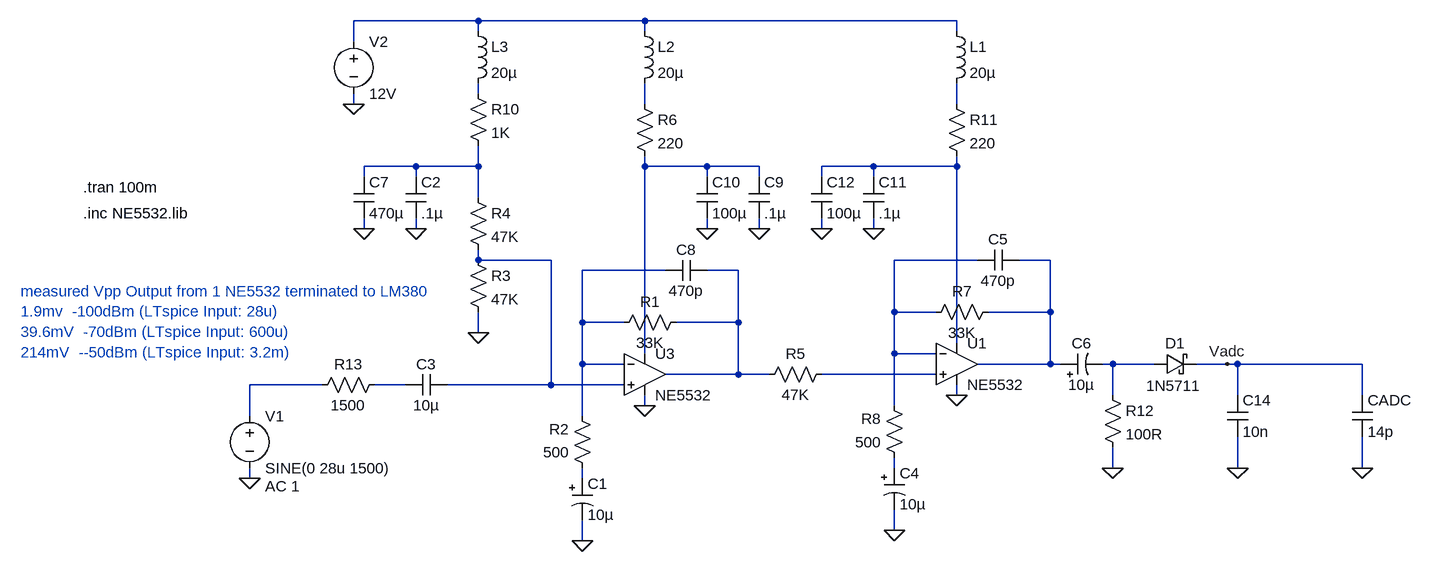
[diagram p0: schematic SMeter Detector NE5532.asc]
SMeter Detector NE5532.asc, the LTspice schematic file:
Version 4
SHEET 1 2204 680
WIRE 96 -400 -96 -400
WIRE 352 -400 96 -400
WIRE 832 -400 352 -400
WIRE 96 -384 96 -400
WIRE 352 -384 352 -400
WIRE 832 -384 832 -400
WIRE -96 -368 -96 -400
WIRE 96 -288 96 -304
WIRE -96 -272 -96 -288
WIRE 352 -272 352 -304
WIRE 832 -272 832 -304
WIRE 0 -176 -80 -176
WIRE 96 -176 96 -208
WIRE 96 -176 0 -176
WIRE 352 -176 352 -192
WIRE 448 -176 352 -176
WIRE 528 -176 448 -176
WIRE 704 -176 624 -176
WIRE 832 -176 832 -192
WIRE 832 -176 704 -176
WIRE -80 -160 -80 -176
WIRE 0 -160 0 -176
WIRE 448 -160 448 -176
WIRE 528 -160 528 -176
WIRE 624 -160 624 -176
WIRE 704 -160 704 -176
WIRE 96 -128 96 -176
WIRE -80 -80 -80 -96
WIRE 0 -80 0 -96
WIRE 448 -80 448 -96
WIRE 528 -80 528 -96
WIRE 624 -80 624 -96
WIRE 704 -80 704 -96
WIRE 96 -32 96 -48
WIRE 208 -32 96 -32
WIRE 864 -32 736 -32
WIRE 976 -32 928 -32
WIRE 384 -16 256 -16
WIRE 496 -16 448 -16
WIRE 736 48 736 -32
WIRE 800 48 736 48
WIRE 976 48 976 -32
WIRE 976 48 880 48
WIRE 256 64 256 -16
WIRE 320 64 256 64
WIRE 496 64 496 -16
WIRE 496 64 400 64
WIRE 96 80 96 48
WIRE 832 96 832 -176
WIRE 352 112 352 -176
WIRE 736 112 736 48
WIRE 800 112 736 112
WIRE 256 128 256 64
WIRE 320 128 256 128
WIRE 976 128 976 48
WIRE 976 128 864 128
WIRE 992 128 976 128
WIRE 1072 128 1056 128
WIRE 1136 128 1072 128
WIRE 1248 128 1200 128
WIRE 1264 128 1248 128
WIRE 1456 128 1264 128
WIRE 496 144 496 64
WIRE 496 144 384 144
WIRE 544 144 496 144
WIRE 800 144 624 144
WIRE -144 160 -256 160
WIRE -16 160 -64 160
WIRE 208 160 208 -32
WIRE 208 160 48 160
WIRE 320 160 208 160
WIRE 832 176 832 160
WIRE 1072 176 1072 128
WIRE 1264 176 1264 128
WIRE 1456 176 1456 128
WIRE 352 192 352 176
WIRE 736 192 736 112
WIRE -256 208 -256 160
WIRE 256 208 256 128
WIRE 736 288 736 272
WIRE 1072 288 1072 256
WIRE 1264 288 1264 240
WIRE 1456 288 1456 240
WIRE -256 304 -256 288
WIRE 256 304 256 288
WIRE 736 384 736 352
WIRE 256 400 256 368
FLAG -96 -272 0
FLAG -256 304 0
FLAG 1264 288 0
FLAG 1456 288 0
FLAG 1248 128 Vadc
FLAG 1072 288 0
FLAG 256 400 0
FLAG 96 80 0
FLAG 352 192 0
FLAG 736 384 0
FLAG 832 176 0
FLAG -80 -80 0
FLAG 0 -80 0
FLAG 448 -80 0
FLAG 528 -80 0
FLAG 624 -80 0
FLAG 704 -80 0
SYMBOL cap 48 144 R90
WINDOW 0 0 32 VBottom 2
WINDOW 3 32 32 VTop 2
SYMATTR InstName C3
SYMATTR Value 10µ
SYMBOL voltage -256 192 R0
WINDOW 123 24 124 Left 2
WINDOW 39 0 0 Left 2
SYMATTR Value2 AC 1
SYMATTR InstName V1
SYMATTR Value SINE(0 28u 1500)
SYMBOL voltage -96 -384 R0
WINDOW 123 0 0 Left 2
WINDOW 39 0 0 Left 2
SYMATTR InstName V2
SYMATTR Value 12V
SYMBOL schottky 1136 144 R270
WINDOW 0 32 32 VTop 2
WINDOW 3 -2 30 VBottom 2
SYMATTR InstName D1
SYMATTR Value 1N5711
SYMATTR Description Diode
SYMATTR Type diode
SYMBOL cap 1248 176 R0
SYMATTR InstName C14
SYMATTR Value 10n
SYMBOL cap 1440 176 R0
SYMATTR InstName CADC
SYMATTR Value 14p
SYMBOL res 1056 160 R0
SYMATTR InstName R12
SYMATTR Value 100R
SYMBOL OpAmps\\opamp2 352 80 R0
SYMATTR InstName U3
SYMATTR Value NE5532
SYMBOL res 416 48 R90
WINDOW 0 0 56 VBottom 2
WINDOW 3 32 56 VTop 2
SYMATTR InstName R1
SYMATTR Value 33K
SYMBOL res 272 304 R180
WINDOW 0 36 76 Left 2
WINDOW 3 36 40 Left 2
SYMATTR InstName R2
SYMATTR Value 500
SYMBOL polcap 240 304 R0
WINDOW 3 24 56 Left 2
SYMATTR Value 10µ
SYMATTR InstName C1
SYMATTR Description Capacitor
SYMATTR Type cap
SYMATTR SpiceLine V=16 Irms=35m Rser=1.95183 Lser=4.15924n mfg="Würth Elektronik" pn="860020372001 WCAP-ATG5 5x11" type="Al electrolytic"
SYMBOL res 80 -48 R0
SYMATTR InstName R3
SYMATTR Value 47K
SYMBOL res 80 -144 R0
SYMATTR InstName R4
SYMATTR Value 47K
SYMBOL res 336 -288 R0
SYMATTR InstName R6
SYMATTR Value 220
SYMBOL res 816 -288 R0
SYMATTR InstName R11
SYMATTR Value 220
SYMBOL cap 384 0 R270
WINDOW 0 32 32 VTop 2
WINDOW 3 0 32 VBottom 2
SYMATTR InstName C8
SYMATTR Value 470p
SYMBOL OpAmps\\opamp2 832 64 R0
SYMATTR InstName U1
SYMATTR Value NE5532
SYMBOL res 896 32 R90
WINDOW 0 0 56 VBottom 2
WINDOW 3 32 56 VTop 2
SYMATTR InstName R7
SYMATTR Value 33K
SYMBOL res 752 288 R180
WINDOW 0 36 76 Left 2
WINDOW 3 36 40 Left 2
SYMATTR InstName R8
SYMATTR Value 500
SYMBOL polcap 720 288 R0
WINDOW 3 24 56 Left 2
SYMATTR Value 10µ
SYMATTR InstName C4
SYMATTR Description Capacitor
SYMATTR Type cap
SYMATTR SpiceLine V=16 Irms=35m Rser=1.95183 Lser=4.15924n mfg="Würth Elektronik" pn="860020372001 WCAP-ATG5 5x11" type="Al electrolytic"
SYMBOL cap 864 -16 R270
WINDOW 0 32 32 VTop 2
WINDOW 3 0 32 VBottom 2
SYMATTR InstName C5
SYMATTR Value 470p
SYMBOL res 640 128 R90
WINDOW 0 0 56 VBottom 2
WINDOW 3 32 56 VTop 2
SYMATTR InstName R5
SYMATTR Value 47K
SYMBOL ind 816 -400 R0
SYMATTR InstName L1
SYMATTR Value 20µ
SYMBOL ind 336 -400 R0
SYMATTR InstName L2
SYMATTR Value 20µ
SYMBOL ind 80 -400 R0
SYMATTR InstName L3
SYMATTR Value 20µ
SYMBOL res 80 -304 R0
SYMATTR InstName R10
SYMATTR Value 1K
SYMBOL cap -16 -160 R0
SYMATTR InstName C2
SYMATTR Value .1µ
SYMBOL cap -96 -160 R0
SYMATTR InstName C7
SYMATTR Value 470µ
SYMBOL cap 512 -160 R0
SYMATTR InstName C9
SYMATTR Value .1µ
SYMBOL cap 432 -160 R0
SYMATTR InstName C10
SYMATTR Value 100µ
SYMBOL cap 688 -160 R0
SYMATTR InstName C11
SYMATTR Value .1µ
SYMBOL cap 608 -160 R0
SYMATTR InstName C12
SYMATTR Value 100µ
SYMBOL res -48 144 R90
WINDOW 0 0 56 VBottom 2
WINDOW 3 32 56 VTop 2
SYMATTR InstName R13
SYMATTR Value 1500
SYMBOL polcap 992 144 R270
WINDOW 3 0 32 VBottom 2
WINDOW 0 32 32 VTop 2
SYMATTR Value 10µ
SYMATTR InstName C6
SYMATTR Description Capacitor
SYMATTR Type cap
SYMATTR SpiceLine V=16 Irms=35m Rser=1.95183 Lser=4.15924n
TEXT -512 -144 Left 2 !.tran 100m
TEXT -512 -104 Left 2 !.inc NE5532.lib
TEXT -608 16 Left 2 ;measured Vpp Output from 1 NE5532 terminated to LM380\n1.9mv  -100dBm (LTspice Input: 28u)\n39.6mV  -70dBm (LTspice Input: 600u)\n214mV  --50dBm (LTspice Input: 3.2m)

The netlist it stands for:
* SMeter Detector NE5532.asc
C3 N008 N016 10µ
V1 N015 0 SINE(0 28u 1500) AC 1
V2 N001 0 12V
D1 N013 Vadc 1N5711
C14 Vadc 0 10n
CADC Vadc 0 14p
R12 N013 0 100R
XU3 N008 N011 N006 0 N012 NE5532  ; pins In+ In- V+ V- OUT
R1 N012 N011 33K
R2 N018 N011 500
C1 N018 0 10µ V=16 Irms=35m Rser=1.95183 Lser=4.15924n mfg="Würth Elektronik" pn="860020372001 WCAP-ATG5 5x11" type="Al electrolytic"
R3 N008 0 47K
R4 N005 N008 47K
R6 N003 N006 220
R11 N004 N007 220
C8 N011 N012 470p
XU1 N014 N009 N007 0 N010 NE5532  ; pins In+ In- V+ V- OUT
R7 N010 N009 33K
R8 N017 N009 500
C4 N017 0 10µ V=16 Irms=35m Rser=1.95183 Lser=4.15924n mfg="Würth Elektronik" pn="860020372001 WCAP-ATG5 5x11" type="Al electrolytic"
C5 N009 N010 470p
R5 N014 N012 47K
L1 N001 N004 20µ
L2 N001 N003 20µ
L3 N001 N002 20µ
R10 N002 N005 1K
C2 N005 0 .1µ
C7 N005 0 470µ
C9 N006 0 .1µ
C10 N006 0 100µ
C11 N007 0 .1µ
C12 N007 0 100µ
R13 N016 N015 1500
C6 N010 N013 10µ V=16 Irms=35m Rser=1.95183 Lser=4.15924n
.model D D
.lib standard.dio
.tran 100m
.inc NE5532.lib
* measured Vpp Output from 1 NE5532 terminated to LM380
* 1.9mv  -100dBm (LTspice Input: 28u)
* 39.6mV  -70dBm (LTspice Input: 600u)
* 214mV  --50dBm (LTspice Input: 3.2m)
.backanno
.end